# EAGLE design Shunt Regulator (EAGLE 7.7.0)
AUTHOR: Nathan Campos; REVISION: A
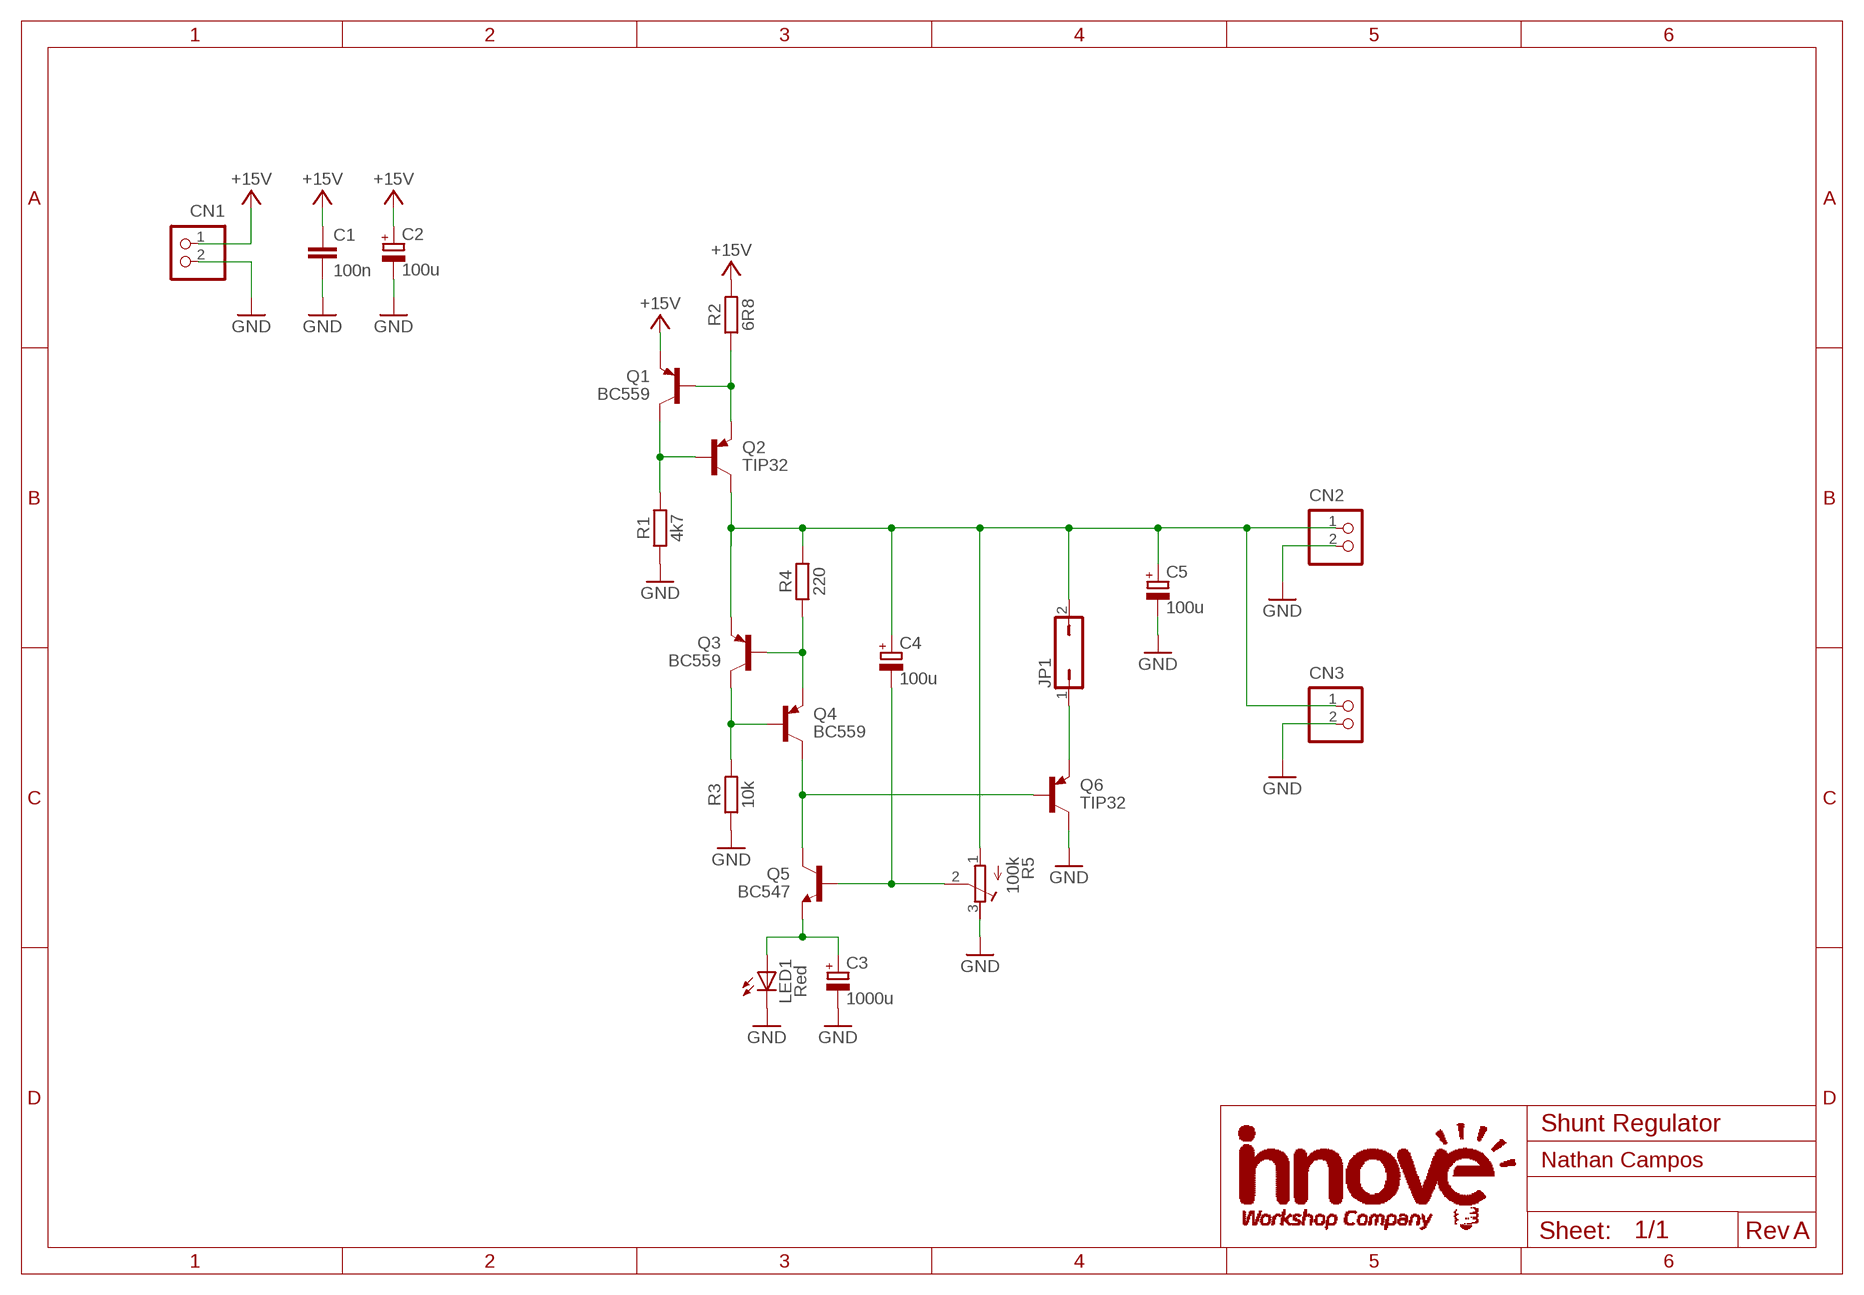
[diagram p0: schematic, sheet 1]

## Parts
C1  100n  C5.0-2.5X7.5  [C050-025X075]
C2  100u  CPOL-E2.5-6  [E2,5-6]
C3  1000u  CPOL-E5-10  [E5-10]
C4  100u  CPOL-E2.5-6  [E2,5-6]
C5  100u  CPOL-E2.5-6  [E2,5-6]
CN1  B2B-XH-A  [B2B-XH-A]
CN2  B2B-XH-A  [B2B-XH-A]
CN3  B2B-XH-A  [B2B-XH-A]
JP1  JP1Q  [JP1]
LED1  Red  LED5MM  [LED5MM]
Q1  BC559  [TO92]
Q2  TIP32  [TO220V]
Q3  BC559  [TO92]
Q4  BC559  [TO92]
Q5  BC547  [TO92]
Q6  TIP32  [TO220V]
R1  4k7  RT0207  [0207/10]
R2  6R8  RT0207  [0207/10]
R3  10k  RT0207  [0207/10]
R4  220  RT0207  [0207/10]
R5  100k  R-TRIMM3296Y  [RTRIM3296Y]

## Nets
+15V: C1.1 C2.+ CN1.1 Q1.3(E) R2.2
GND: C1.2 C2.- C3.- C5.- CN1.2 CN2.2 CN3.2 LED1.K(C) Q6.2(C) R1.1 R3.1 R5.3(E)
N$1: Q1.1(C) Q2.1(B) R1.2
N$2: Q1.2(B) Q2.3(E) R2.1
N$4: Q4.1(C) Q5.1(C) Q6.1(B)
N$5: Q3.2(B) Q4.3(E) R4.1
N$6: Q3.1(C) Q4.2(B) R3.2
N$7: C3.+ LED1.A Q5.3(E)
N$8: C4.- Q5.2(B) R5.2(S)
N$9: JP1.1 Q6.3(E)
OUTPUT: C4.+ C5.+ CN2.1 CN3.1 JP1.2 Q2.2(C) Q3.3(E) R4.2 R5.1(A)

## Library data of the parts
C1 = innove-passives:C: Ceramic Capacitor Those little yellow/brown things
C2-C5 = innove-passives:CPOL: Polarized Capacitor May come in the electrolytic and tantalum variants
CN1-CN3 = innove-con-jst-xh:B2B-XH-A: Wire-to-Board 2.5mm pitch top mount connector Source: http://www.jst-mfg.com/product/pdf/jpn/XH.pdf http://www.jst-mfg.com/product/detail.php?series=277
JP1 = jumper:JP1Q: JUMPER
LED1 = innove-leds:LED: LED OSRAM: - CHIPLED LG R971, LG N971, LY N971, LG Q971, LY Q971, LO R971, LY R971 LH N974, LH R974 LS Q976, LO Q976, LY Q976 LO Q996 - Hyper CHIPLED LW Q18S LB Q993, LB Q99A, LB R99A - SideLED LS A670, LO A670, LY A670, LG A670, LP A670 LB A673, LV A673, LT A673, LW A673 LH A674 LY A675 LS A676, LA A676, LO A676, LY A676, LW A676 LS A679, LY A679, LG A679 - Hyper Micro SIDELED® LS Y876, LA Y876, LO Y876, LY Y876 LT Y87S - SmartLED LW L88C, LW L88S LB L89C, LB L89S, LG L890 LS L89K, LO L89K, LY L89K LS L896, LA L896, LO L896, LY L896 - TOPLED LS T670, LO T670, LY T670, LG T670, LP T670 LSG T670, LSP T670, LSY T670, LOP T670, LYG T670 LG T671, LOG T671, LSG T671 LB T673, LV T673, LT T673, LW T673 LH T674 LS T676, LA T676, LO T676, LY T676, LB T676, LH T676, LSB T676, LW T676 LB T67C, LV T67C, LT T67C, LS T67K, LO T67K, LY T67K, LW E67C LS E67B, LA E67B, LO E67B, LY E67B, LB E67C, LV E67C, LT E67C LW T67C LS T679, LY T679, LG T679 LS T770, LO T770, LY T770, LG T770, LP T770 LB T773, LV T773, LT T773, LW T773 LH T774 LS E675, LA E675, LY E675, LS T675 LS T776, LA T776, LO T776, LY T776, LB T776 LHGB T686 LT T68C, LB T68C - Hyper Mini TOPLED® LB M676 - Mini TOPLED Santana® LG M470 LS M47K, LO M47K, LY M47K Source: http://www.osram.convergy.de LUXEON: - LUMILED® LXK2-PW12-R00, LXK2-PW12-S00, LXK2-PW14-U00, LXK2-PW14-V00 LXK2-PM12-R00, LXK2-PM12-S00, LXK2-PM14-U00 LXK2-PE12-Q00, LXK2-PE12-R00, LXK2-PE12-S00, LXK2-PE14-T00, LXK2-PE14-U00 LXK2-PB12-K00, LXK2-PB12-L00, LXK2-PB12-M00, LXK2-PB14-N00, LXK2-PB14-P00, LXK2-PB14-Q00 LXK2-PR12-L00, LXK2-PR12-M00, LXK2-PR14-Q00, LXK2-PR14-R00 LXK2-PD12-Q00, LXK2-PD12-R00, LXK2-PD12-S00 LXK2-PH12-R00, LXK2-PH12-S00 LXK2-PL12-P00, LXK2-PL12-Q00, LXK2-PL12-R00 Source: www.luxeon.com KINGBRIGHT: KA-3528ASYC Source: www.kingbright.com
Q1 Q3 Q4 = innove-bjts:BC559
Q2 Q6 = innove-bjts:TIP32
Q5 = innove-bjts:BC547
R1-R4 = innove-passives:R: Resistor This is officially the most boring component ever.
R5 = rcl:R-TRIMM: Trimm resistor

## Board
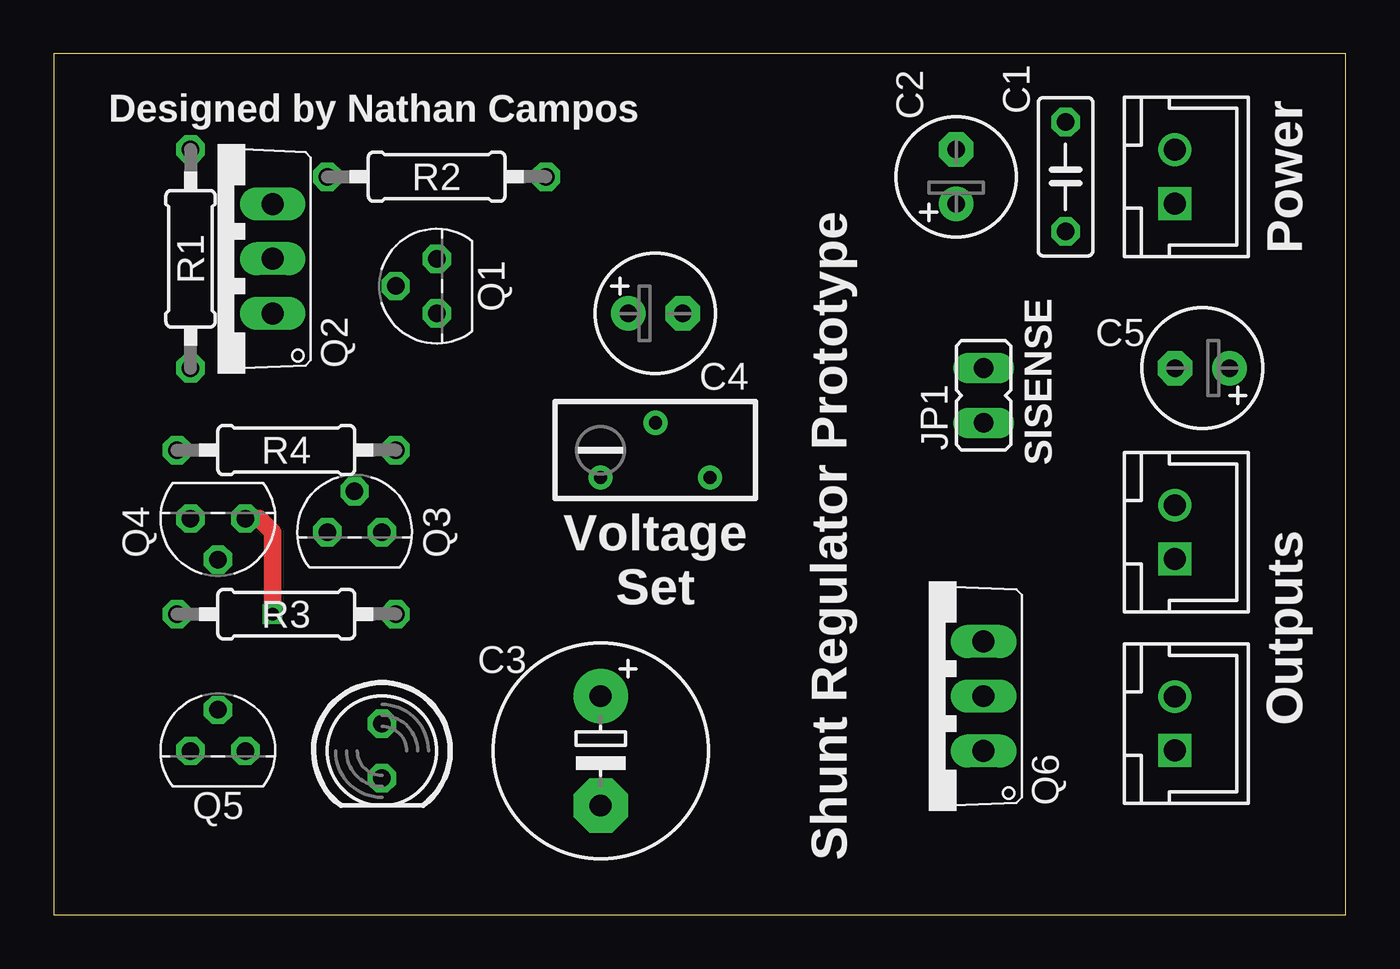
[diagram p1: board, top side]
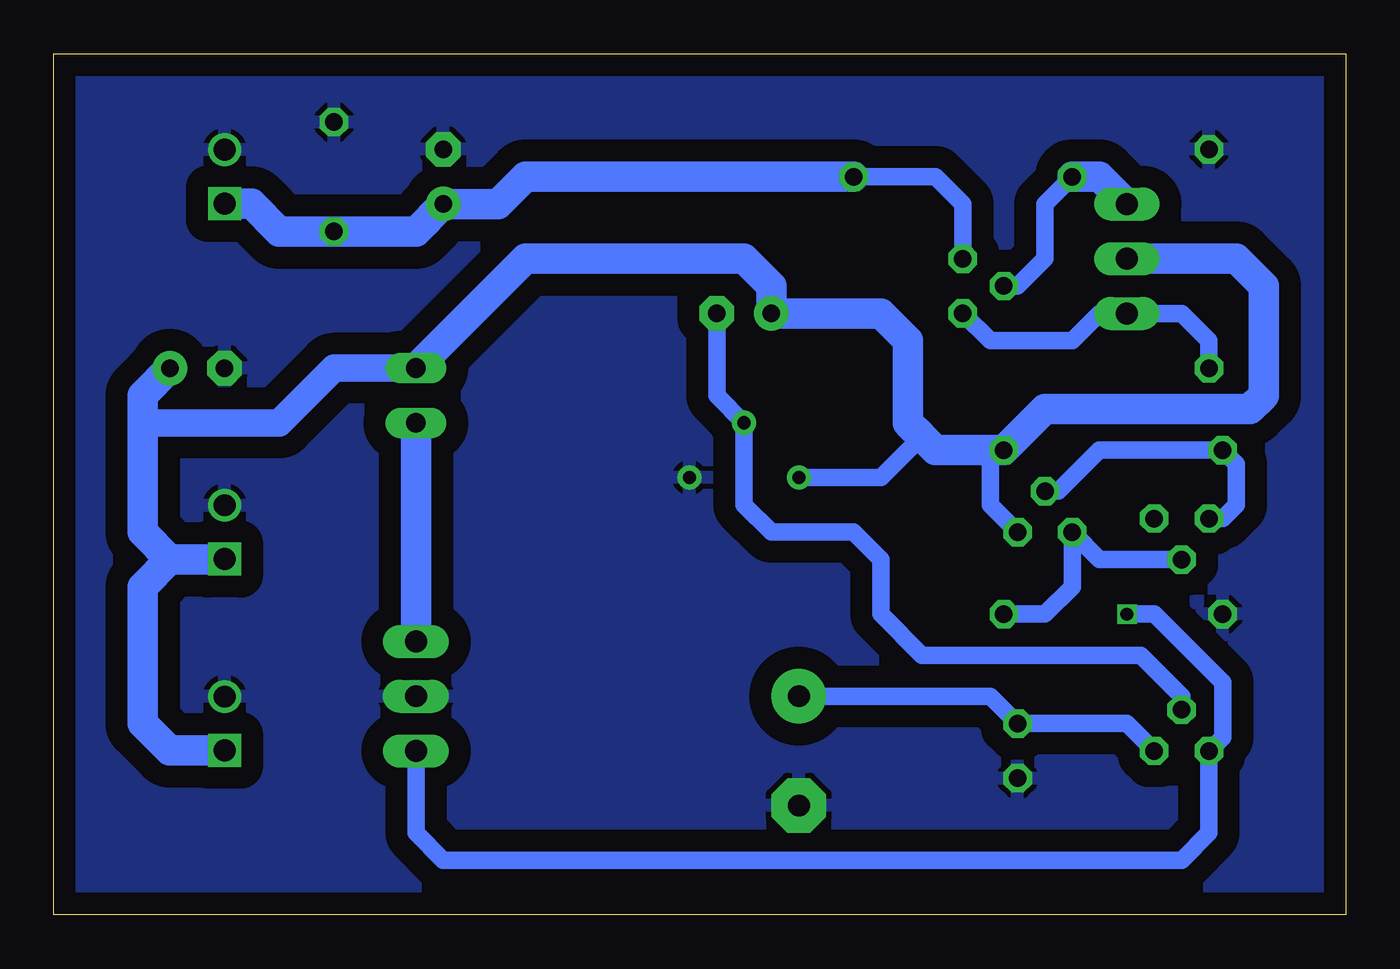
[diagram p2: board, bottom side, seen from below]

Size 60 x 40 mm. Coordinates in mm from the lower left corner, seen from the top.
Outline: 0,0 60,0 60,40 0,40 0,0
Copper layers (1*16): Top 0.035mm / dielectric 1.5mm / Bottom 0.035mm
Design rules "seeedstudio-2layers": minimum track width 6mil, minimum drill 12mil, track to track 6mil, track to pad 6mil, pad to pad 6mil, via to via 6mil, smd to smd 0mil, copper to edge 10mil, drill to drill 10mil, minimum pad ring 10mil, minimum via ring 6mil, stop-mask expansion 2mil, vias tented up to drill 100mil, thermal gap 10mil

### Footprints (pad centres in the part's own frame; a part is rotated, then mirrored left to right if it is on the bottom)
C050-025X075 = drill 0.813 octagon: 1 -2.54,0; 2 2.54,0
E2,5-6 = drill 0.813 pad 1.6: + -1.27,0 | drill 0.813 pad 1.6 octagon: - 1.27,0
E5-10 = drill 1.016 pad 2.54: + -2.54,0 | drill 1.016 pad 2.54 octagon: - 2.54,0
B2B-XH-A = drill 1.016 square: 1 -1.25,0 | drill 1.016: 2 1.25,0
JP1 = drill 0.914 long: 1 0,-1.27; 2 0,1.27
LED5MM = drill 0.813 octagon: A -1.27,0; K 1.27,0
TO92 = drill 0.813 octagon: 1 -1.27,0; 2 0,1.905; 3 1.27,0
TO220V = drill 1.016 long: 1 -2.54,-2.54; 2 0,-2.54; 3 2.54,-2.54
0207/10 = drill 0.813 octagon: 1 -5.08,0; 2 5.08,0
RTRIM3296Y = drill 0.61: 1 1.27,-2.54; 2 -1.27,0; 3 1.27,2.54

### Placement (x,y rotation side)
C1  46.99,34.29 90 top
C2  41.91,34.29 90 top
C3  25.4,7.62 270 top
C4  27.94,27.94 0 top
C5  53.34,25.4 180 top
CN1  52.07,34.29 90 top
CN2  52.07,8.89 90 top
CN3  52.07,17.78 90 top
JP1  43.18,24.13 0 top
LED1  15.24,7.62 270 top
Q1  17.78,29.21 90 top
Q2  7.62,30.48 90 top
Q3  13.97,17.78 0 top
Q4  7.62,18.41 180 top
Q5  7.62,7.62 0 top
Q6  40.64,10.16 90 top
R1  6.35,30.48 270 top
R2  17.78,34.29 0 top
R3  10.79,13.97 0 top
R4  10.79,21.59 0 top
R5  27.94,21.59 270 top

### Tracks (layer width: path | path; a pad name or v marks a point on that pad's centre or on a via)
+15V
  Bottom 0.813: Q1.3 17.78,33.02 19.05,34.29 R2.2
  Bottom 1.422: CN1.1 50.82,33.04 49.53,31.75 C1.1 43.18,31.75 C2.+ 39.37,33.02 38.1,34.29 R2.2
GND
  pour Bottom (isolate 1.016): 0,40.64 60.96,40.64 60.96,0 0,0
N$1
  Bottom 0.813: R1.2 6.35,26.67 7.62,27.94 Q2.1 11.43,27.94 12.7,26.67 16.51,26.67 Q1.1
N$2
  Bottom 0.813: Q1.2 15.24,29.21 13.97,30.48 13.97,33.02 R2.1
  Bottom 1.422: Q2.3 11.43,34.29 R2.1
N$4  (via drill 0.6)
  Top 0.813: Q4.1 9.53,18.41 10.16,17.78 v10.16,13.97
  Bottom 0.813: Q6.1 43.18,3.81 41.91,2.54 7.62,2.54 6.35,3.81 Q5.1 5.71,8.26 5.71,10.79 8.89,13.97 v10.16,13.97
N$5
  Bottom 0.813: Q3.2 13.34,19.68 11.43,21.59 R4.1 5.08,20.95 5.08,19.05 5.71,18.41 Q4.3
N$6
  Bottom 0.813: Q4.2 11.43,16.51 Q3.1 12.7,15.24 13.97,13.97 R3.2
N$7
  Bottom 0.813: C3.+ 16.51,10.16 LED1.A 10.16,8.89 Q5.3
N$8
  Bottom 0.813: C4.- 29.21,24.13 R5.2 27.94,19.05 26.67,17.78 22.86,17.78 21.59,16.51 21.59,13.97 19.68,12.06 9.53,12.06 7.62,10.16 Q5.2
N$9
  Bottom 1.422: JP1.1 Q6.3
OUTPUT
  Bottom 0.813: R5.1 21.59,20.32 19.68,22.23 | Q3.3 16.51,19.05 16.51,21.59
  Bottom 1.27: JP1.2 46.99,25.4 49.53,22.86 55.88,22.86
  Bottom 1.422: C5.+ 55.88,24.13 55.88,22.86 55.88,17.78 54.61,16.51 | 54.61,16.51 52.09,16.51 CN3.1 | CN2.1 54.63,7.64 55.88,8.89 55.88,15.24 54.61,16.51 | JP1.2 38.1,30.48 27.94,30.48 26.67,29.21 C4.+ 21.59,27.94 20.32,26.67 20.32,22.86 19.68,22.23 19.05,21.59 16.51,21.59 R4.2 13.97,23.5 4.45,23.5 3.81,24.13 3.81,29.21 5.08,30.48 Q2.2

### Text on the board
tPlace: Designed by Nathan Campos | Power | SISENSE | Voltage / Set | Outputs | Shunt Regulator Prototype